# EAGLE design ha_notchecker (EAGLE 9.6.2)
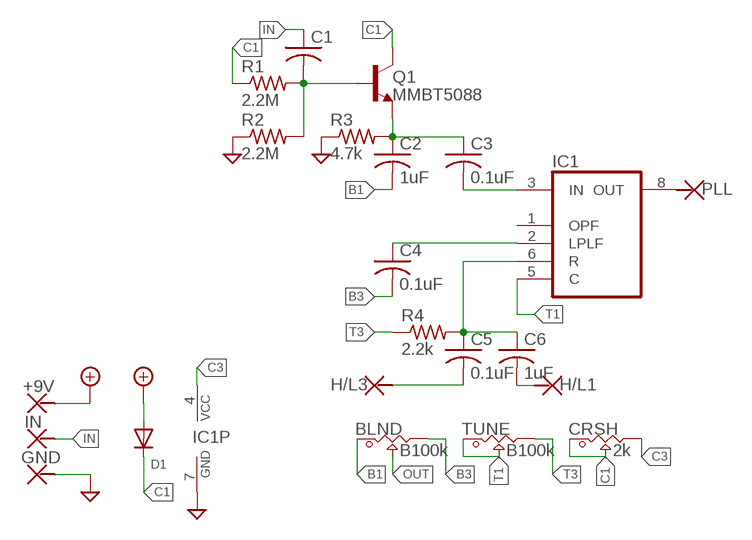
[diagram p0: schematic, sheet 1]

## Parts
+9V  PAD  [PAD]
BLND  B100k  POT_9MM_SMD  [POT_9MM_SMD]
C1  C-USC0603  [C0603]
C2  1uF  C-USC0603  [C0603]
C3  0.1uF  C-USC0603  [C0603]
C4  0.1uF  C-USC0603  [C0603]
C5  0.1uF  C-USC0603  [C0603]
C6  1uF  C-USC0603  [C0603]
CRSH  2k  POT_9MM_SMD  [POT_9MM_SMD]
D1  DIODESOD-123  [SOD-123]
GND  PAD  [PAD]
H/L1  PAD  [PAD]
H/L3  PAD  [PAD]
IC1  XR-567K  [JSOP-08]
IN  PAD  [PAD]
PLL  PAD  [PAD]
Q1  MMBT5088  [SOT23-BEC]
R1  2.2M  R-US_R0603  [R0603]
R2  2.2M  R-US_R0603  [R0603]
R3  4.7k  R-US_R0603  [R0603]
R4  2.2k  R-US_R0603  [R0603]
TUNE  B100k  POT_9MM_SMD  [POT_9MM_SMD]

## Nets
+9V: +9V.P$1 D1.A
B1: BLND.1 C2.2
B3: BLND.3 C4.2
C1: CRSH.1 CRSH.2 D1.C Q1.C R1.1
C3: CRSH.3 IC1.4(VCC)
GND: GND.P$1 IC1.7(GND) R2.1 R3.1
IN: C1.1 IN.P$1
N$1: C1.2 Q1.B R1.2 R2.2
N$2: C2.1 C3.1 Q1.E R3.2
N$3: C3.2 IC1.3(IN)
N$4: C4.1 IC1.2(LPLF)
N$5: C5.1 C6.1 IC1.6(R) R4.2
N$6: C5.2 H/L3.P$1
N$7: C6.2 H/L1.P$1
N$8: IC1.8(OUT) PLL.P$1
OUT: BLND.2
T1: IC1.5(C) TUNE.1 TUNE.2
T3: R4.1 TUNE.3
Unconnected: IC1.1(OPF)

## Library data of the parts
+9V GND H/L1 H/L3 IN PLL = SMD_Pad:PAD
BLND CRSH TUNE = Potentiometers_SMD:POT_9MM_SMD
C1-C6 = adafruit:C-US: CAPACITOR, American symbol
D1 = adafruit:DIODE: Diode SMADIODE - SMA Surface Mount Package 20V 1A Schottky Diode Digikey: 641-1014-6-ND DO-1N4148 - Through Hole Small Current Diode SOD-123 20V 1 A (.5mV Vf) Schottky Diode - Digikey: MBRX120TPMSCT-ND SOD-323 10V 570mA (.38mV Vf, 3ns) Schottky Diode - Digikey: ZLLS410CT-ND SOD-523 30V 30mA Schottky Diode (RB751S-40TE61) - Digikey: RB751S-40TE61CT-ND SOT23-R/W - SOT23 Package (R = Solder Paste/Reflow Ovens, W = Hand-Soldering) BAT54Film 40V 300mA - Digikey: 497-7162-1-ND
IC1 = exar:XR-567K: TONE DECODER; OC_FARNELL: unknown; OC_NEWARK: unknown
Q1 = MMBT5088_:MMBT5088*: NPN TRANSISTOR Check prices <https://pricing.snapeda.com/search/part/MMBT5088/?ref=eda>; AVAILABILITY: Good; DESCRIPTION: Bipolar (BJT) Transistor NPN 30V 100mA 50MHz 350mW Surface Mount SOT-23; MF: ON Semiconductor; MP: MMBT5088; PACKAGE: SOT-23-3 Fairchild Semiconductor; PRICE: None; PURCHASE-URL: https://pricing.snapeda.com/search/part/MMBT5088/?ref=eda
R1-R4 = adafruit:R-US_: RESISTOR, American symbol

## Board
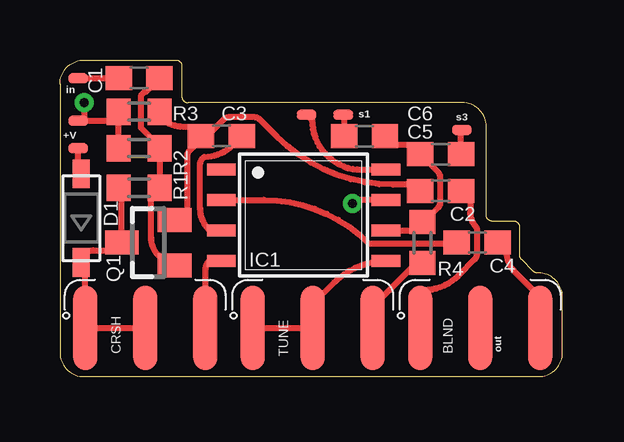
[diagram p1: board, top side]
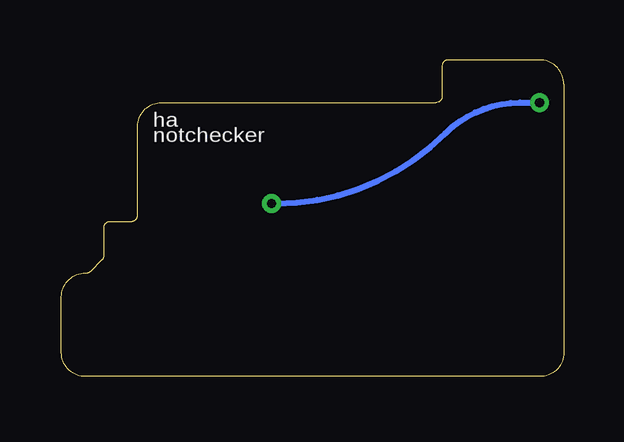
[diagram p2: board, bottom side, seen from below]

Size 20.95 x 13.21 mm. Coordinates in mm from the lower left corner, seen from the top.
Outline: 0,12.19 0,1 arc90 1,0 19.95,0 arc90 20.95,1 20.95,3.32 arc90 19.95,4.32 19.92,4.32 arc-45 19.74,4.39 19.25,4.88 arc-45 19.18,5.06 19.18,6.22 arc90 18.92,6.48 18.03,6.48 arc-90 17.78,6.73 17.78,10.43 arc90 16.78,11.43 5.33,11.43 arc-90 5.08,11.68 5.08,12.95 arc90 4.83,13.21 1.02,13.21 arc90 0,12.19
Copper layers (1*16): Top 0.035mm / dielectric 1.5mm / Bottom 0.035mm
Design rules "default *": minimum track width 6mil, minimum drill 0.35mm, track to track 6mil, track to pad 6mil, pad to pad 6mil, via to via 6mil, smd to smd 6mil, copper to edge 10mil, drill to drill 6mil, minimum pad ring 10mil, minimum via ring 8mil, stop-mask expansion 4mil, vias tented up to drill 0mil, thermal gap 10mil

### Footprints (pad centres in the part's own frame; a part is rotated, then mirrored left to right if it is on the bottom)
PAD = smd 0.813 x 0.406: P$1 0,0
POT_9MM_SMD = smd 0.991 x 3.505: 1 -2.5,0; 2 0,0; 3 2.5,0
C0603 = smd 1.1 x 1: 1 -0.85,0; 2 0.85,0
SOD-123 = smd 1.2 x 0.7: A 1.85,0; C -1.85,0
JSOP-08 = smd 0.5 x 1.2: 1 -1.905,-3.429; 2 -0.635,-3.429; 3 0.635,-3.429; 4 1.905,-3.429; 5 1.913,3.429; 6 0.643,3.429; 7 -0.627,3.429; 8 -1.897,3.429
SOT23-BEC = smd 1 x 1.4: B -0.95,-1.1; C 0,1.1; E 0.95,-1.1
R0603 = smd 1 x 1.1: 1 -0.85,0; 2 0.85,0

### Placement (x,y rotation side)
+9V  0.76,9.53 0 top
BLND  17.53,2.03 0 top
C1  3.3,12.45 0 top
C2  15.88,7.75 0 top
C3  6.73,10.03 0 top
C4  17.4,5.59 0 top
C5  15.88,9.27 0 top
C6  12.7,10.03 180 top
CRSH  3.56,2.03 0 top
D1  0.89,6.6 90 top
GND  0.76,10.67 0 top
H/L1  11.81,10.92 0 top
H/L3  16.76,10.29 0 top
IC1  10.16,6.73 270 top
IN  0.76,12.45 0 top
PLL  10.29,10.92 0 top
Q1  3.68,5.59 90 top
R1  3.3,7.87 0 top
R2  3.3,9.53 0 top
R3  3.3,11.05 0 top
R4  15.11,5.59 90 top
TUNE  10.54,2.03 0 top

### Tracks (layer width: path | path; a pad name or v marks a point on that pad's centre or on a via)
+9V
  Top 0.254: D1.A 0.76,8.58 +9V.P$1
B1
  Top 0.254: C2.2 17.11,7.37 17.11,6.86 arc45 17.38,6.2 17.38,5.08 arc-45 17.3,4.9 16.61,4.2 arc-45 15.16,3.6 15.03,3.47 BLND.1
B3
  Top 0.254: C4.2 18.63,5.21 arc45 18.99,4.34 20.03,3.3 BLND.3
C1
  Top 0.254: CRSH.2 CRSH.1 1.06,4.59 D1.C arc-90 1.4,5.26 2.26,5.26 Q1.C 2.58,7.74 R1.1
C3
  Top 0.254: CRSH.3 6.06,4.42 arc-45 6.22,4.83 IC1.4
GND  (via drill 0.38)
  Top 0.254: R2.1 R3.1 2.07,10.67 GND.P$1 1.02,10.67 v1.02,11.43 | IC1.7 12.34,7.36 v12.19,7.21
  Bottom 0.254: v12.19,7.21 12.02,7.21 arc-45 4.95,10.14 arc45 1.84,11.43 v1.02,11.43
IN
  Top 0.254: IN.P$1 C1.1
N$1
  Top 0.254: Q1.B 4.53,4.64 4.1,5.07 arc-45 3.8,5.78 3.8,7.53 R1.2 R2.2 4.15,9.6 3.37,10.38 3.37,11.71 3.54,11.88 3.58,11.88 C1.2
N$2
  Top 0.254: R3.2 4.15,10.83 arc45 5.15,10.41 5.5,10.41 C3.1 5.61,9.76 5.73,9.76 | 5.73,9.76 5.39,9.41 arc45 5.31,9.23 5.31,6.81 5.04,6.54 Q1.E | C2.1 14.77,8 13.9,8 arc-45 9.05,10.01 8.32,10.74 arc45 8.14,10.81 7.02,10.81 arc45 6.84,10.74 5.86,9.76 5.73,9.76
N$3
  Top 0.254: IC1.3 6.71,6.12 6.22,6.12 arc-45 5.85,7.02 5.85,8.9 arc-45 5.93,9.08 6.01,9.16 arc45 7.21,9.66 C3.2
N$4
  Top 0.254: IC1.2 8.51,7.37 arc-45 12.87,5.56 16.52,5.56 C4.1
N$5
  Top 0.254: IC1.6 14.76,6.09 R4.2 15.16,6.44 15.78,7.06 arc45 15.85,7.24 15.85,8.34 arc45 15.78,8.52 C5.1 14.64,9.65 13.93,9.65 C6.1
N$6
  Top 0.254: C5.2 16.73,10.25 H/L3.P$1
N$7
  Top 0.254: H/L1.P$1 11.85,10.88 C6.2
N$8
  Top 0.254: PLL.P$1 10.51,10.7 arc90 12.58,8.63 IC1.8
T1
  Top 0.254: TUNE.1 TUNE.2 10.54,3.03 11.44,3.93 arc-45 IC1.5
T3
  Top 0.254: TUNE.3 13.04,2.91 14.7,4.57 arc-45 R4.1

### Text on the board
tPlace: in | s1 | s3 | +V | out
bPlace: ha | notchecker